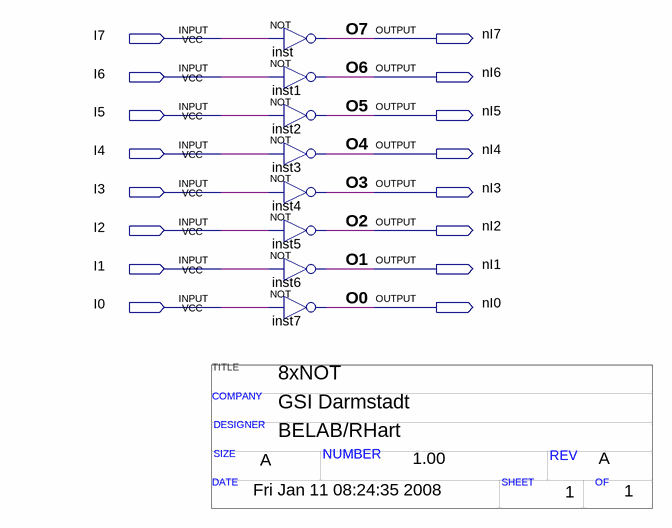
[diagram p0: schematic sheet]
// Quartus schematic 8xnot.bdf as structural Verilog: 8 symbols, 16 pins
// Title block: TITLE: 8xNOT; COMPANY: GSI Darmstadt; DESIGNER: BELAB/RHart; SIZE: A; NUMBER: 1.00; REV: A; DATE: Fri Jan 11 08:24:35 2008; SHEET: 1; OF: 1
module \8xnot  (
  input  I7,
  input  I6,
  input  I5,
  input  I4,
  input  I3,
  input  I2,
  input  I1,
  input  I0,
  output nI7,
  output nI6,
  output nI5,
  output nI4,
  output nI3,
  output nI2,
  output nI1,
  output nI0
);

  not inst (nI7, I7);
  not inst1 (nI6, I6);
  not inst2 (nI5, I5);
  not inst3 (nI4, I4);
  not inst4 (nI3, I3);
  not inst5 (nI2, I2);
  not inst6 (nI1, I1);
  not inst7 (nI0, I0);

  // Other names for the same wires on the sheet: O0 = nI0; O1 = nI1; O2 = nI2; O3 = nI3; O4 = nI4; O5 = nI5; O6 = nI6;
  //   O7 = nI7
endmodule
